# EAGLE design PolarTableMegaShield (EAGLE 9.2.2)
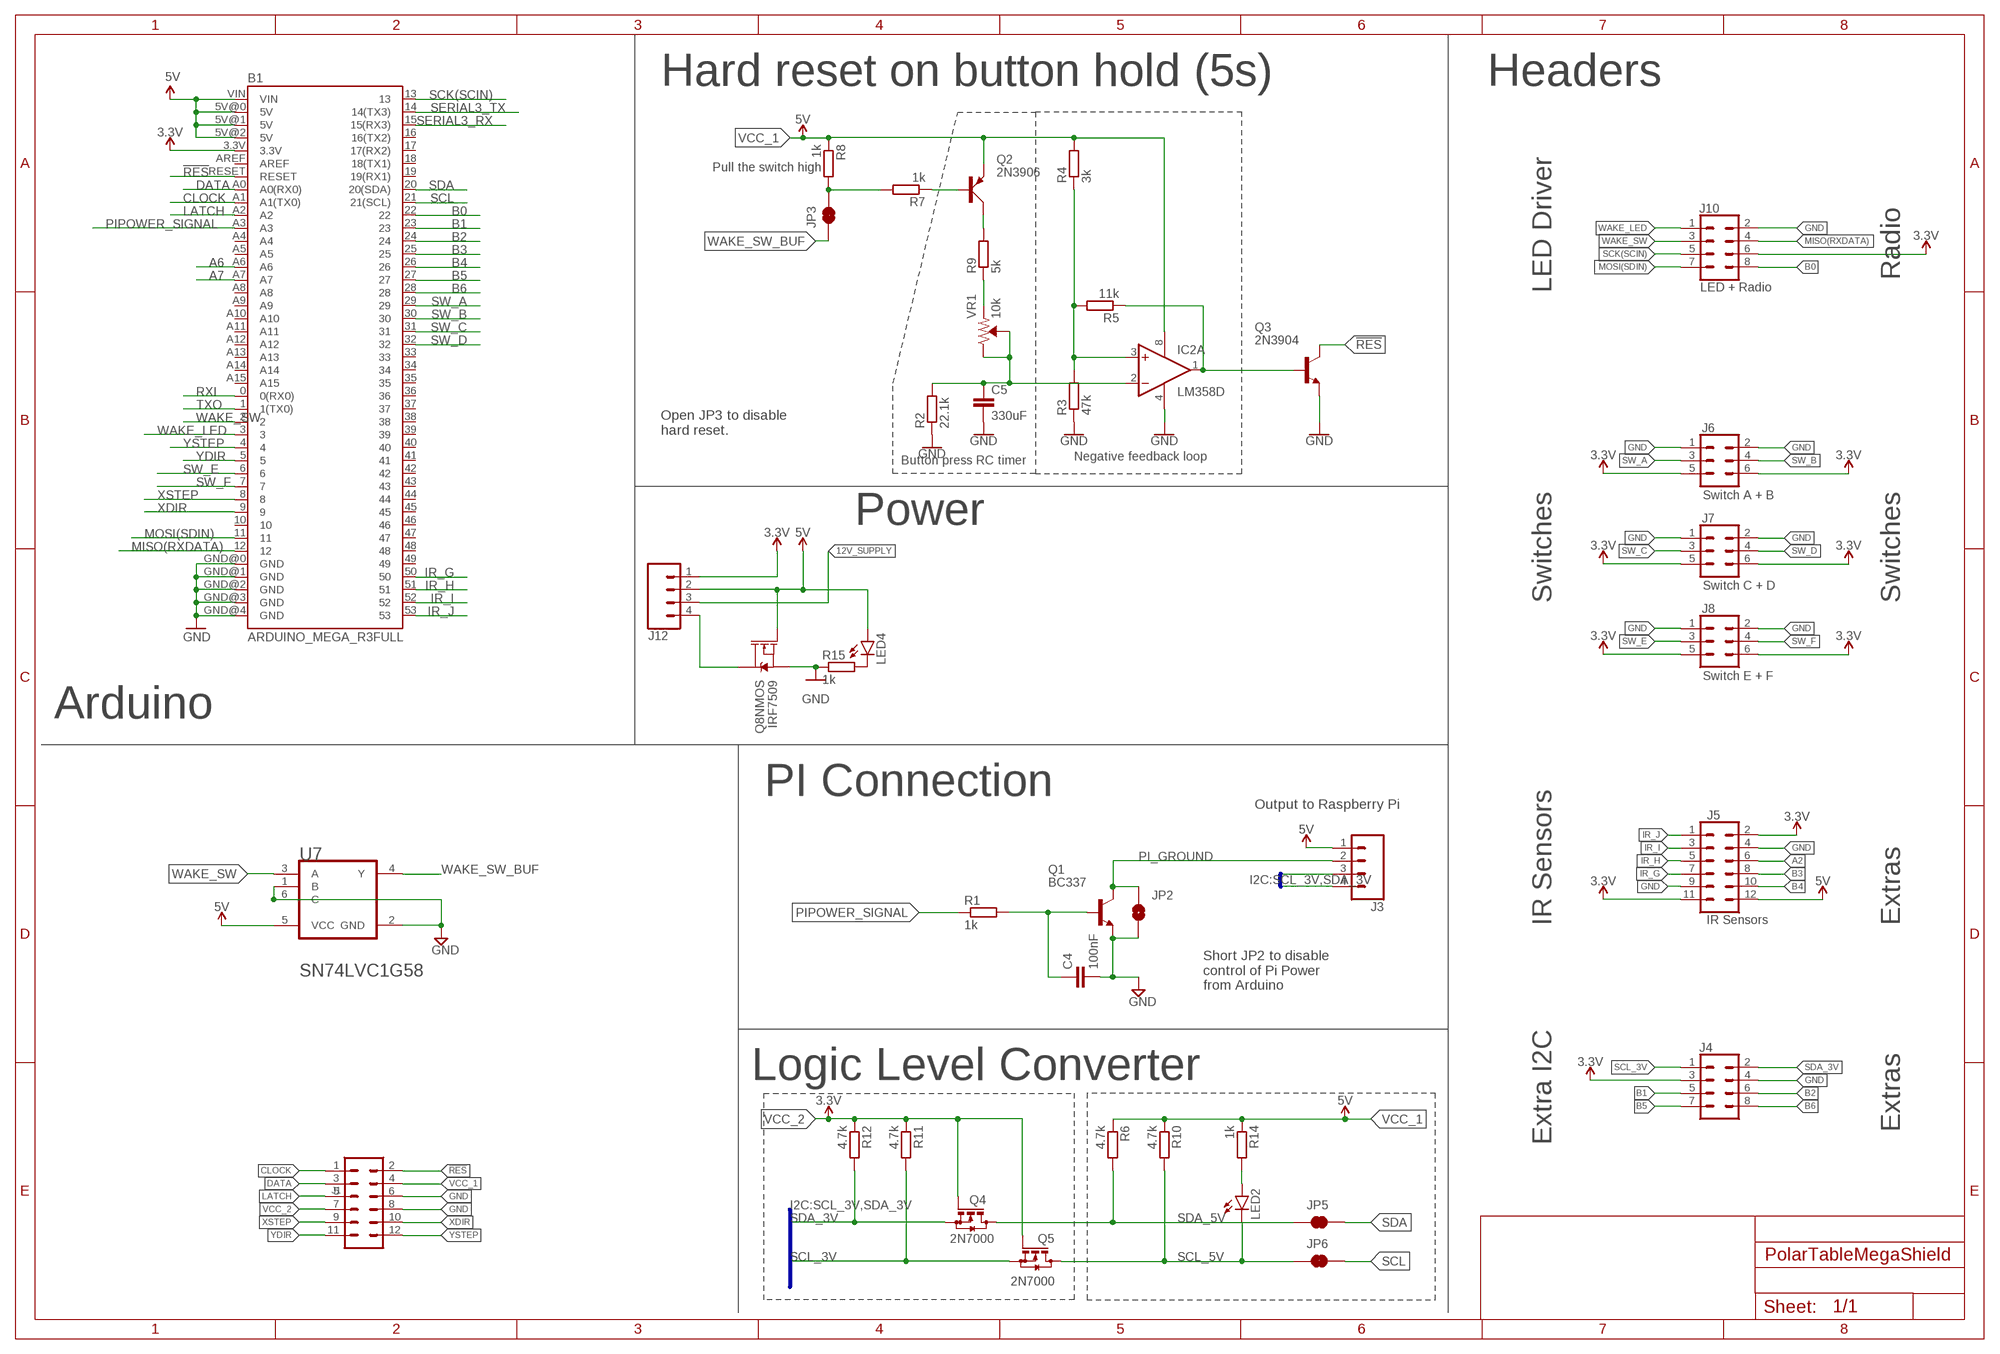
[diagram p0: schematic, sheet 1]

## Parts
B1  ARDUINO_MEGA_R3FULL  [ARDUINO_MEGA]
C4  100nF  C-EUC0805  [C0805]
C5  330uF  C-EUC0805  [C0805]
IC2  LM358D  [SO08]
J1  CONN_06X21.24MM_RA_MALE  [2X6]
J3  Pi Connection  CONN_041X04_1.24MM_RA_MALE  [1X04_1.24MM_RA_MALE]
J4  CONN_04X22X4_1.24MM_RA_MALE  [2X4]
J5  IR Sensors  CONN_06X21.24MM_RA_MALE  [2X6]
J6  Switch A + B  CONN_03X22X03_2.54MM_RA_MALE  [2X3]
J7  Switch C + D  CONN_03X22X03_2.54MM_RA_MALE  [2X3]
J8  Switch E + F  CONN_03X22X03_2.54MM_RA_MALE  [2X3]
J10  LED + Radio  CONN_04X22X4_1.24MM_RA_MALE  [2X4]
J12  CONN_04JST-PTH  [JST-4-PTH]
JP2  JUMPER-SMT_2_NO_SILK  [SMT-JUMPER_2_NO_SILK]
JP3  Enable Hold to Reset  JUMPER-SMT_2_NC_TRACE_SILK  [SMT-JUMPER_2_NC_TRACE_SILK]
JP5  JUMPER-SMT_2_NC_TRACE_NO-SILK  [SMT-JUMPER_2_NC_TRACE_NO-SILK]
JP6  JUMPER-SMT_2_NC_TRACE_NO-SILK  [SMT-JUMPER_2_NC_TRACE_NO-SILK]
LED2  LEDCHIP-LED0805  [CHIP-LED0805]
LED4  LEDCHIP-LED0805  [CHIP-LED0805]
Q1  BC337  [TO92]
Q2  2N3906  [TO92D]
Q3  2N3904  [TO92]
Q4  2N7000  [TO92-]
Q5  2N7000  [TO92-]
Q8  IRF7509  [MSOP8]
R1  1k  R-EU_M0805  [M0805]
R2  22.1k  R-EU_M0805  [M0805]
R3  47k  R-EU_M0805  [M0805]
R4  3k  R-EU_M0805  [M0805]
R5  11k  R-EU_M0805  [M0805]
R6  4.7k  R-EU_M0805  [M0805]
R7  1k  R-EU_M0805  [M0805]
R8  1k  R-EU_M0805  [M0805]
R9  5k  R-EU_M0805  [M0805]
R10  4.7k  R-EU_M0805  [M0805]
R11  4.7k  R-EU_M0805  [M0805]
R12  4.7k  R-EU_M0805  [M0805]
R14  1k  R-EU_M0805  [M0805]
R15  1k  R-EU_M0805  [M0805]
U7  Buffer  TEXAS_INSTRUMENTS_SN74LVC1G58SOT363  [SOT363_PHILIPS]
VR1  10k  TRIMPOT-PTH-10MM-KNOB-1/2W-10%  [TRIMPOT-PTH-3386U]

## Nets
12V_SUPPLY [12v_Supply]: J12.3
!RES [5v]: B1.RESET J1.2 Q3.1(C)
$N99 [5v]: JP3.2 R7.2 R8.2
A2 [5v]: J5.6
A6 [5v]: B1.A6
A7 [5v]: B1.A7
B0 [3v]: B1.22 J10.8
B1 [3v]: B1.23 J4.5
B2 [3v]: B1.24 J4.6
B3 [5v]: B1.25 J5.8
B4 [5v]: B1.26 J5.10
B5 [3v]: B1.27 J4.7
B6 [3v]: B1.28 J4.8
CLOCK [5v]: B1.A1(A1(TX0)) J1.1
COMP_OUT [5v]: IC2.1(A:OUT) Q3.2(B) R5.1
DATA [5v]: B1.A0(A0(RX0)) J1.3
GND [5v]: B1.GND@0(GND) B1.GND@1(GND) B1.GND@2(GND) B1.GND@3(GND) B1.GND@4(GND) C4.2 C5.2 IC2.4(P:V-) J1.6 J1.8 J4.4 J5.4 J5.9 J6.1 J6.2 J7.1 J7.2 J8.1 J8.2 J10.2 JP2.2 Q1.1(E) Q3.3(E) Q8.1(NMOS:S) R2.1 R3.1 R15.1 U7.1(B) U7.2(GND) U7.6(C)
IR_G [3v]: B1.50 J5.7
IR_H [3v]: B1.51 J5.5
IR_I [3v]: B1.52 J5.3
IR_J [3v]: B1.53 J5.1
LATCH [5v]: B1.A2 J1.5
MISO(RXDATA) [5v]: B1.12 J10.4
MOSI(SDIN) [5v]: B1.11 J10.7
N$1 [5v]: Q2.B R7.1
N$2 [5v]: C4.1 Q1.2(B) R1.2
N$3 [5v]: Q2.C R9.2
N$4: J12.4 Q8.7(NMOS:D) Q8.8(NMOS:D)
N$5 [5v]: IC2.3(A:+IN) R3.2 R4.1 R5.2
N$6 [5v]: R9.1 VR1.1(CCW)
N$8 [5v]: C5.1 IC2.2(A:-IN) R2.2 VR1.2(WIPER) VR1.3(CW)
N$9: LED4.C R15.2
N$10 [5v]: LED2.A R14.2
PI_GROUND [5v]: J3.2 JP2.1 Q1.3(C)
PIPOWER_SIGNAL [5v]: B1.A3 R1.1
RXI [5v]: B1.0(0(RX0))
SCK(SCIN) [5v]: B1.13 J10.5
SCL [5v]: B1.21(21(SCL)) JP6.2
SCL_3V [3v]: J3.3 J4.1 Q5.1(S) R11.2
SCL_5V [5v]: JP6.1 LED2.C Q5.3(D) R10.2
SDA [5v]: B1.20(20(SDA)) JP5.2
SDA_3V [3v]: J3.4 J4.2 Q4.1(S) R12.2
SDA_5V [5v]: JP5.1 Q4.3(D) R6.2
SERIAL3_RX: B1.15(15(RX3))
SERIAL3_TX: B1.14(14(TX3))
SW_A [3v]: B1.29 J6.3
SW_B [3v]: B1.30 J6.4
SW_C [3v]: B1.31 J7.3
SW_D [3v]: B1.32 J7.4
SW_E [5v]: B1.6 J8.3
SW_F [5v]: B1.7 J8.4
TXO [5v]: B1.1(1(TX0))
VCC_1 [5v]: B1.5V@0(5V) B1.5V@1(5V) B1.5V@2(5V) B1.VIN IC2.8(P:V+) J1.4 J3.1 J5.12 J12.2 LED4.A Q2.E Q8.2(NMOS:G) R4.2 R6.1 R8.1 R10.1 R14.1 U7.5(VCC) ; supply symbol labelled 5V
VCC_2 [3v]: B1.3.3V J1.7 J4.3 J5.2 J5.11 J6.5 J6.6 J7.5 J7.6 J8.5 J8.6 J10.6 J12.1 Q4.2(G) Q5.2(G) R11.1 R12.1 ; supply symbol labelled 3.3V
WAKE_LED [3v]: B1.3 J10.1
WAKE_SW [5v]: B1.2 J10.3 U7.3(A)
WAKE_SW_BUF [5v]: JP3.1 U7.4(Y)
XDIR [5v]: B1.9 J1.10
XSTEP [5v]: B1.8 J1.9
YDIR [5v]: B1.5 J1.11
YSTEP [5v]: B1.4 J1.12
Unconnected: B1.10 B1.16(16(TX2)) B1.17(17(RX2)) B1.18(18(TX1)) B1.19(19(RX1)) B1.33 B1.34 B1.35 B1.36 B1.37 B1.38 B1.39 B1.40 B1.41 B1.42 B1.43 B1.44 B1.45 B1.46 B1.47 B1.48 B1.49 B1.A4 B1.A5 B1.A8 B1.A9 B1.A10 B1.A11 B1.A12 B1.A13 B1.A14 B1.A15 B1.AREF IC2.5(B:+IN) IC2.6(B:-IN) IC2.7(B:OUT) Q8.3(PMOS:S) Q8.4(PMOS:G) Q8.5(PMOS:D) Q8.6(PMOS:D)

## Buses
I2C:SCL_3V,SDA_3V

## Notes on the sheet
- Hard reset on button hold (5s) | Headers
- Radio
- LED Driver
- Open JP3 to disable
  hard reset.
- Negative feedback loop
- Button press RC timer
- Power
- Switches | Switches
- Arduino
- PI Connection
- Output to Raspberry Pi
- IR Sensors | Extras
- Short JP2 to disable
  control of Pi Power
  from Arduino
- Logic Level Converter
- Extras
- Extra I2C

## Library data of the parts
B1 = SparkFun-Boards:ARDUINO_MEGA_R3: Arduino Mega R3 ATmega2560 R3 compatible footprint. SparkFun Products: Arduino Mega 2560 R3 <https://www.sparkfun.com/products/11061>
C4 C5 = resistor:C-EU: CAPACITOR, European symbol
IC2 = keir_library:LM358: OP AMP also LM158; LM258; LM2904 Source: http://cache.national.com/ds/LM/LM158.pdf
J1 J5 = keir_library:CONN_06X2: Multi connection point. Often used as Generic Header-pin footprint for 0.1 inch spaced/style header connections On any of the 0.1 inch spaced packages, you can populate with these: Break Away Headers - Straight <https://www.sparkfun.com/products/116> (PRT-00116) Break Away Male Headers - Right Angle <https://www.sparkfun.com/products/553> (PRT-00553) Female Headers <https://www.sparkfun.com/products/115> (PRT-00115) Break Away Headers - Machine Pin <https://www.sparkfun.com/products/117> (PRT-00117) Break Away Female Headers - Swiss Machine Pin <https://www.sparkfun.com/products/743> (PRT-00743)
J3 = keir_library:CONN_04: Multi connection point. Often used as Generic Header-pin footprint for 0.1 inch spaced/style header connections On any of the 0.1 inch spaced packages, you can populate with these: Break Away Headers - Straight <https://www.sparkfun.com/products/116> (PRT-00116) Break Away Male Headers - Right Angle <https://www.sparkfun.com/products/553> (PRT-00553) Female Headers <https://www.sparkfun.com/products/115> (PRT-00115) Break Away Headers - Machine Pin <https://www.sparkfun.com/products/117> (PRT-00117) Break Away Female Headers - Swiss Machine Pin <https://www.sparkfun.com/products/743> (PRT-00743) For SCREWTERMINALS and SPRING TERMINALS visit here: Screw Terimnals on SparkFun.com <https://www.sparkfun.com/search/results?term=Screw+Terminals> (5mm/3.5mm/2.54mm spacing) This device is also useful as a general connection point to wire up your design to another part of your project. Our various solder wires solder well into these plated through hole pads. Hook-Up Wire - Assortment (Stranded, 22 AWG) <https://www.sparkfun.com/products/11375> (PRT-11375) Hook-Up Wire - Assortment (Solid Core, 22 AWG) <https://www.sparkfun.com/products/11367> (PRT-11367) View the entire wire category on our website here <https://www.sparkfun.com/categories/141> Special notes: Molex polarized connector foot print use with SKU : PRT-08231 with associated crimp pins and housings. 1MM SMD Version SKU: PRT-10208
J4 J10 = keir_library:CONN_04X2: Multi connection point. Often used as Generic Header-pin footprint for 0.1 inch spaced/style header connections On any of the 0.1 inch spaced packages, you can populate with these: Break Away Headers - Straight <https://www.sparkfun.com/products/116> (PRT-00116) Break Away Male Headers - Right Angle <https://www.sparkfun.com/products/553> (PRT-00553) Female Headers <https://www.sparkfun.com/products/115> (PRT-00115) Break Away Headers - Machine Pin <https://www.sparkfun.com/products/117> (PRT-00117) Break Away Female Headers - Swiss Machine Pin <https://www.sparkfun.com/products/743> (PRT-00743)
J6-J8 = keir_library:CONN_03X2: Multi connection point. Often used as Generic Header-pin footprint for 0.1 inch spaced/style header connections You can populate with any combo of single row headers, but if you'd like an exact match, check these: Header - 2x3 (Male, 0.1") <https://www.sparkfun.com/products/12807> (PRT-12807) Header - 2x3 (Female, 0.1") <https://www.sparkfun.com/products/13010> (PRT-13010) 2x3 Pin Shrouded Header <https://www.sparkfun.com/products/10877> (PRT-10877) On any of the 0.1 inch spaced packages, you can populate with these: Break Away Headers - Straight <https://www.sparkfun.com/products/116> (PRT-00116) Break Away Male Headers - Right Angle <https://www.sparkfun.com/products/553> (PRT-00553) Female Headers <https://www.sparkfun.com/products/115> (PRT-00115) Break Away Headers - Machine Pin <https://www.sparkfun.com/products/117> (PRT-00117) Break Away Female Headers - Swiss Machine Pin <https://www.sparkfun.com/products/743> (PRT-00743) Special note: the shrouded connector mates well with our 3x2 ribbon cables: Ribbon Crimp Connector - 6-pin (2x3, Female) <https://www.sparkfun.com/products/10651> (PRT-10651) Ribbon Cable - 6 wire (15ft) <https://www.sparkfun.com/products/10646> (PRT-10646)
J12 = SparkFun-Connectors:CONN_04: Multi connection point. Often used as Generic Header-pin footprint for 0.1 inch spaced/style header connections On any of the 0.1 inch spaced packages, you can populate with these: Break Away Headers - Straight <https://www.sparkfun.com/products/116> (PRT-00116) Break Away Male Headers - Right Angle <https://www.sparkfun.com/products/553> (PRT-00553) Female Headers <https://www.sparkfun.com/products/115> (PRT-00115) Break Away Headers - Machine Pin <https://www.sparkfun.com/products/117> (PRT-00117) Break Away Female Headers - Swiss Machine Pin <https://www.sparkfun.com/products/743> (PRT-00743) For SCREWTERMINALS and SPRING TERMINALS visit here: Screw Terimnals on SparkFun.com <https://www.sparkfun.com/search/results?term=Screw+Terminals> (5mm/3.5mm/2.54mm spacing) This device is also useful as a general connection point to wire up your design to another part of your project. Our various solder wires solder well into these plated through hole pads. Hook-Up Wire - Assortment (Stranded, 22 AWG) <https://www.sparkfun.com/products/11375> (PRT-11375) Hook-Up Wire - Assortment (Solid Core, 22 AWG) <https://www.sparkfun.com/products/11367> (PRT-11367) View the entire wire category on our website here <https://www.sparkfun.com/categories/141> Special notes: Molex polarized connector foot print use with SKU : PRT-08231 with associated crimp pins and housings. 1MM SMD Version SKU: PRT-10208; PROD_ID: WIRE-13531; SF_ID: PRT-09916
JP2 = SparkFun-Jumpers:JUMPER-SMT_2_NO: Normally open jumper This jumper has two pads in close proximity to each other. Apply solder to close the connection. Round pads are easier to solder for beginners, but are a lot larger. SparkFun Product that uses the round pads: SparkFun EL Sequencer <https://www.sparkfun.com/products/12781>
JP3 JP5 JP6 = SparkFun-Jumpers:JUMPER-SMT_2_NC_TRACE: Normally closed trace jumper This jumper has a trace between two pads so it's normally closed (NC). Use a razor knife to open the connection. For best results follow the IPC guidelines for cutting traces: Cutout at least 0.063 mm (0.005 in). Remove all loose material to clean up the cut area. Seal the cut with an approved epoxy. Reapply solder to reclose the connection.
LED2 LED4 = led:LED: LED OSRAM: - CHIPLED LG R971, LG N971, LY N971, LG Q971, LY Q971, LO R971, LY R971 LH N974, LH R974 LS Q976, LO Q976, LY Q976 LO Q996 - Hyper CHIPLED LW Q18S LB Q993, LB Q99A, LB R99A - SideLED LS A670, LO A670, LY A670, LG A670, LP A670 LB A673, LV A673, LT A673, LW A673 LH A674 LY A675 LS A676, LA A676, LO A676, LY A676, LW A676 LS A679, LY A679, LG A679 - Hyper Micro SIDELED® LS Y876, LA Y876, LO Y876, LY Y876 LT Y87S - SmartLED LW L88C, LW L88S LB L89C, LB L89S, LG L890 LS L89K, LO L89K, LY L89K LS L896, LA L896, LO L896, LY L896 - TOPLED LS T670, LO T670, LY T670, LG T670, LP T670 LSG T670, LSP T670, LSY T670, LOP T670, LYG T670 LG T671, LOG T671, LSG T671 LB T673, LV T673, LT T673, LW T673 LH T674 LS T676, LA T676, LO T676, LY T676, LB T676, LH T676, LSB T676, LW T676 LB T67C, LV T67C, LT T67C, LS T67K, LO T67K, LY T67K, LW E67C LS E67B, LA E67B, LO E67B, LY E67B, LB E67C, LV E67C, LT E67C LW T67C LS T679, LY T679, LG T679 LS T770, LO T770, LY T770, LG T770, LP T770 LB T773, LV T773, LT T773, LW T773 LH T774 LS E675, LA E675, LY E675, LS T675 LS T776, LA T776, LO T776, LY T776, LB T776 LHGB T686 LT T68C, LB T68C - Hyper Mini TOPLED® LB M676 - Mini TOPLED Santana® LG M470 LS M47K, LO M47K, LY M47K Source: http://www.osram.convergy.de LUXEON: - LUMILED® LXK2-PW12-R00, LXK2-PW12-S00, LXK2-PW14-U00, LXK2-PW14-V00 LXK2-PM12-R00, LXK2-PM12-S00, LXK2-PM14-U00 LXK2-PE12-Q00, LXK2-PE12-R00, LXK2-PE12-S00, LXK2-PE14-T00, LXK2-PE14-U00 LXK2-PB12-K00, LXK2-PB12-L00, LXK2-PB12-M00, LXK2-PB14-N00, LXK2-PB14-P00, LXK2-PB14-Q00 LXK2-PR12-L00, LXK2-PR12-M00, LXK2-PR14-Q00, LXK2-PR14-R00 LXK2-PD12-Q00, LXK2-PD12-R00, LXK2-PD12-S00 LXK2-PH12-R00, LXK2-PH12-S00 LXK2-PL12-P00, LXK2-PL12-Q00, LXK2-PL12-R00 Source: www.luxeon.com KINGBRIGHT: KA-3528ASYC Source: www.kingbright.com
Q1 = transistor-npn:BC337*: NPN Transistor
Q2 = transistor-small-signal:2N3906: PNP TRANSISTOR
Q3 = transistor-npn:2N3904: NPN Transistor; NOTE: Pull high until we get comparitor high output
Q4 Q5 = keir_library:2N7000: N-CHANNEL MOS FET
Q8 = SparkFun-DiscreteSemi:IRF7509: Dual N and P Channel MOSFET Dual N/P-Channel 30V 1.25 W 7.8/7.5 nC Hexfet Power Mosfet Surface Mount-MICRO-8. NMOS RDS(ON) 0.11Ω. PMOS RDS(ON) 0.20Ω. Link to datasheet <http://www.irf.com/product-info/datasheets/data/irf7509pbf.pdf> SparkFun Products: SparkFun RedBot Mainboard <https://www.sparkfun.com/products/12097> SparkFun Wake on Shake <https://www.sparkfun.com/products/11447>; PROD_ID: TRANS-07913
R1-R7 R9-R12 R14 R15 = rcl:R-EU_: RESISTOR, European symbol; SPICEPREFIX: R
R8 = rcl:R-EU_: RESISTOR, European symbol; NOTE: Pull the switch high; SPICEPREFIX: R
U7 = Texas Instruments - SN74LVC1G58:TEXAS_INSTRUMENTS_SN74LVC1G58: 74LVC1G58 Low-power configurable multiple function gate Data sheet <https://assets.nexperia.com/documents/data-sheet/74LVC1G58.pdf>
VR1 = SparkFun-Resistors:TRIMPOT: Trimming Potentiometer (Trimpot) Three-terminal potentiometers, with an adjustable wiper and two adjustable resistors. A pot can be used to create a configurable voltage divider, or as a variable resistor. "Trimpots" are a subset of potentiometers, usually intended for "set-and-forget" applications. They're often more delicate than standard potentiometers - rated for fewer turns. Variants PTH-KNOB - PTH Trimpot w/ finger-adjustable knob Trimpot 10K with Knob <https://www.sparkfun.com/products/9806> (COM-09806) Datasheet <http://www.sparkfun.com/datasheets/Components/General/TSR-3386.pdf> SMD-3MM-CLOSED-FRAME - SMD 3mm Square Closed-Frame Trimpot Used on e.g. EasyDriver - Stepper Motor Driver <https://www.sparkfun.com/products/12779> Datasheet <http://www.bitechnologies.com/pdfs/22.pdf> (22AR10KTR) SMD-5MM - SMD 5mm Square Closed-Frame Trimpot Used on e.g. IOIO-OTG - V2.2 <https://www.sparkfun.com/products/13613> Datasheet <http://www.vishay.com/docs/51008/ts53.pdf> (TS53YL502MR10) SMD-3MM-1/10W-25% - 3mm Square Open-Frame Trimpot Used on e.g. SparkFun Shapeoko <https://www.sparkfun.com/products/13899> Datasheet <http://www.bourns.com/docs/Product-Datasheets/TC33.pdf> (TC33X-2-103E); PROD_ID: RES-09730; SF_SKU: COM-09806

## Net classes
1 12v_Supply: width 1.2 mm, clearance 0.31 mm
2 5v_Supply: width 1 mm

## Board
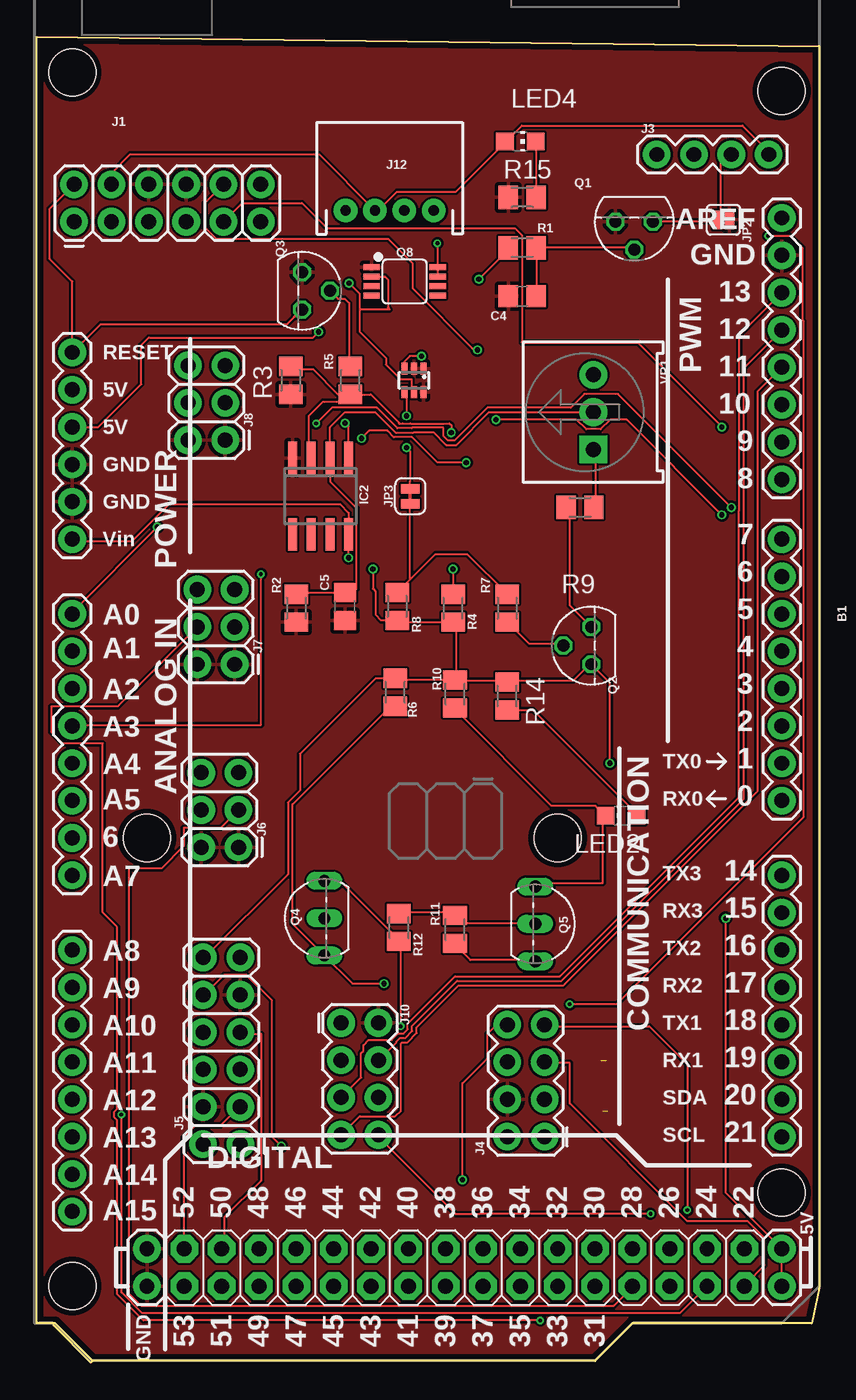
[diagram p1: board, top side]
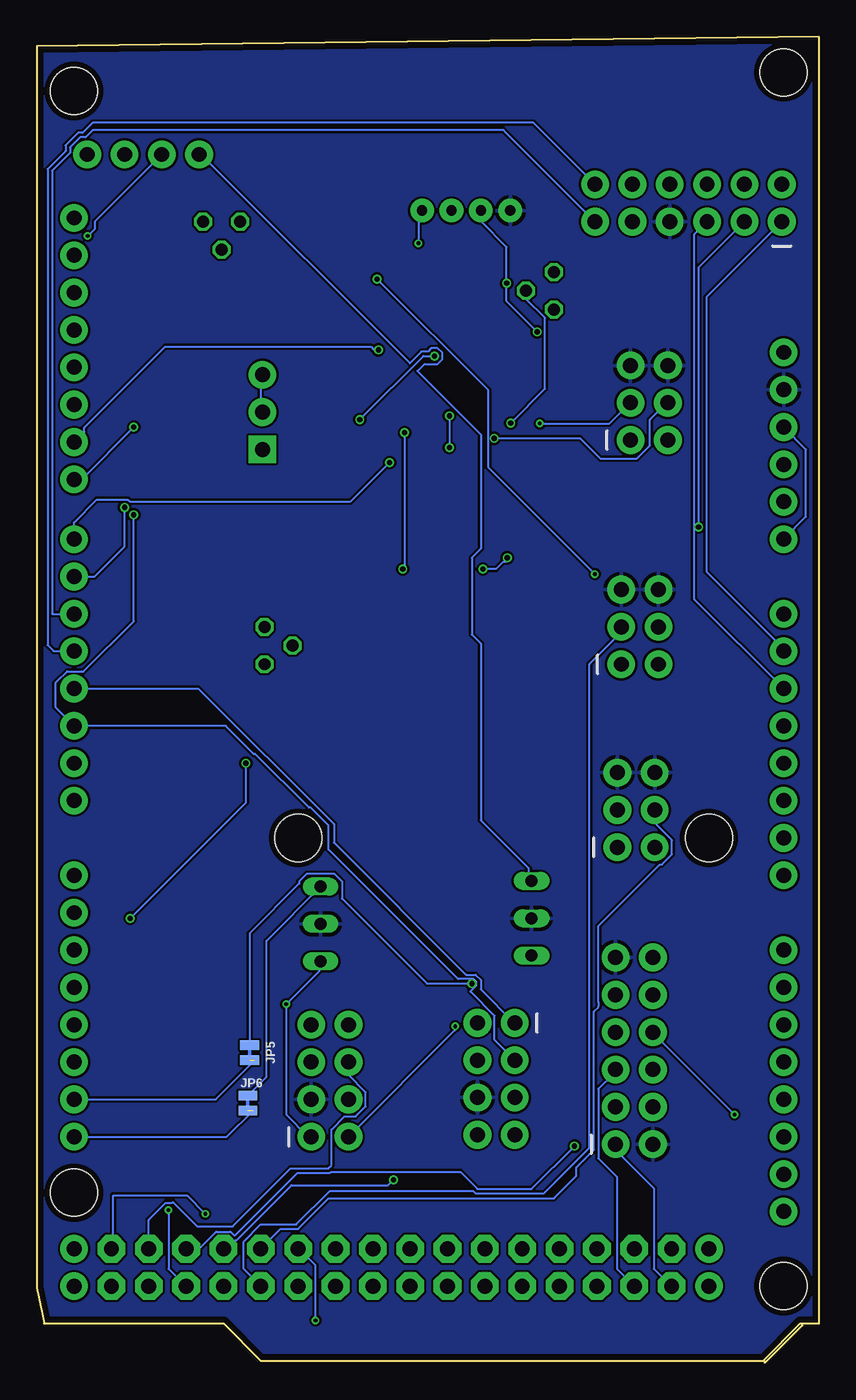
[diagram p2: board, bottom side, seen from below]

Size 53.21 x 90.17 mm. Coordinates in mm from the lower left corner, seen from the top.
Outline: 3.81,0.13 1.27,2.67 1.14,2.67
Outline: 1.14,2.67 0,2.67 0,90.17 53.21,89.53 53.21,5.08 52.7,2.67 40.51,2.67 37.97,0.13 3.81,0.13
Outline: 3.81,0.13 3.68,0 1.14,2.54 1.14,2.67
Copper layers (1*16): Top 0.035559375mm / dielectric 1.6mm / Bottom 0.035559375mm
Design rules "oshpark-2layer": minimum track width 6mil, minimum drill 10mil, track to track 6mil, track to pad 6mil, pad to pad 6mil, via to via 6mil, smd to smd 6mil, copper to edge 15mil, drill to drill 6mil, minimum pad ring 5mil, minimum via ring 5mil, stop-mask expansion 2.5mil, vias tented up to drill 0mil, thermal gap 10mil

### Footprints (pad centres in the part's own frame; a part is rotated, then mirrored left to right if it is on the bottom)
ARDUINO_MEGA = drill 1.016 pad 1.88: 0 13.97,24.13; 1 11.43,24.13; 2 8.89,24.13; 3 6.35,24.13; 3.3V -13.97,-24.13; 4 3.81,24.13; 5 1.27,24.13; 5V@0 -11.43,-24.13; 5V@1 44.45,24.13; 5V@2 46.99,24.13; 6 -1.27,24.13; 7 -3.81,24.13; 8 -7.874,24.13; 9 -10.414,24.13; 10 -12.954,24.13; 11 -15.494,24.13; 12 -18.034,24.13; 13 -20.574,24.13; 14 19.05,24.13; 15 21.59,24.13; 16 24.13,24.13; 17 26.67,24.13; 18 29.21,24.13; 19 31.75,24.13; 20 34.29,24.13; 21 36.83,24.13; A0 1.27,-24.13; A1 3.81,-24.13; A2 6.35,-24.13; A3 8.89,-24.13; A4 11.43,-24.13; A5 13.97,-24.13; A6 16.51,-24.13; A7 19.05,-24.13; A8 24.13,-24.13; A9 26.67,-24.13; A10 29.21,-24.13; A11 31.75,-24.13; A12 34.29,-24.13; A13 36.83,-24.13; A14 39.37,-24.13; A15 41.91,-24.13; AREF -25.654,24.13; GND@0 -8.89,-24.13; GND@1 -6.35,-24.13; GND@2 44.45,-19.05; GND@3 46.99,-19.05; GND@4 -23.114,24.13; RESET -16.51,-24.13; VIN -3.81,-24.13 | drill 1.016 pad 1.88 octagon: 22 44.45,21.59; 23 46.99,21.59; 24 44.45,19.05; 25 46.99,19.05; 26 44.45,16.51; 27 46.99,16.51; 28 44.45,13.97; 29 46.99,13.97; 30 44.45,11.43; 31 46.99,11.43; 32 44.45,8.89; 33 46.99,8.89; 34 44.45,6.35; 35 46.99,6.35; 36 44.45,3.81; 37 46.99,3.81; 38 44.45,1.27; 39 46.99,1.27; 40 44.45,-1.27; 41 46.99,-1.27; 42 44.45,-3.81; 43 46.99,-3.81; 44 44.45,-6.35; 45 46.99,-6.35; 46 44.45,-8.89; 47 46.99,-8.89; 48 44.45,-11.43; 49 46.99,-11.43; 50 44.45,-13.97; 51 46.99,-13.97; 52 44.45,-16.51; 53 46.99,-16.51 | hole 3.2: -34.29,24.13; -35.56,-24.13; 16.51,8.89; 16.51,-19.05; 40.64,24.13; 46.99,-24.13
C0805 = smd 1.3 x 1.5: 1 -0.95,0; 2 0.95,0
SO08 = smd 0.6 x 2.2: 1 -1.905,-2.6; 2 -0.635,-2.6; 3 0.635,-2.6; 4 1.905,-2.6; 5 1.905,2.6; 6 0.635,2.6; 7 -0.635,2.6; 8 -1.905,2.6
2X6 = drill 1.016 pad 1.88: 1 0,0; 2 0,2.54; 3 2.54,0; 4 2.54,2.54; 5 5.08,0; 6 5.08,2.54; 7 7.62,0; 8 7.62,2.54; 9 10.16,0; 10 10.16,2.54; 11 12.7,0; 12 12.7,2.54
1X04_1.24MM_RA_MALE = drill 1.016 pad 1.88: 1 0,0; 2 2.54,0; 3 5.08,0; 4 7.62,0
2X4 = drill 1.016 pad 1.88: 1 -3.81,-1.27; 2 -3.81,1.27; 3 -1.27,-1.27; 4 -1.27,1.27; 5 1.27,-1.27; 6 1.27,1.27; 7 3.81,-1.27; 8 3.81,1.27
2X3 = drill 1.016 pad 1.88: 1 0,0; 2 0,2.54; 3 2.54,0; 4 2.54,2.54; 5 5.08,0; 6 5.08,2.54
JST-4-PTH = drill 0.7 pad 1.6: 1 -3,0; 2 -1,0; 3 1,0; 4 3,0
SMT-JUMPER_2_NO_SILK = smd 0.635 x 1.27: 1 -0.406,0; 2 0.406,0
SMT-JUMPER_2_NC_TRACE_SILK = smd 0.635 x 1.27: 1 -0.508,0; 2 0.508,0
SMT-JUMPER_2_NC_TRACE_NO-SILK = smd 0.635 x 1.27: 1 -0.508,0; 2 0.508,0
CHIP-LED0805 = smd 1.2 x 1.2: A 0,-1.05; C 0,1.05
TO92 = drill 0.813 octagon: 1 1.27,0; 2 0,1.905; 3 -1.27,0
TO92D = drill 0.813 octagon: B 0,1.905; C 1.27,0; E -1.27,0
TO92- = drill 0.813 long: 1 2.54,0; 2 0,0; 3 -2.54,0
MSOP8 = smd 0.4 x 1.1: 1 -0.975,-2.25; 2 -0.325,-2.25; 3 0.325,-2.25; 4 0.975,-2.25; 5 0.975,2.25; 6 0.325,2.25; 7 -0.325,2.25; 8 -0.975,2.25
M0805 = smd 1.3 x 1.6: 1 -0.95,0; 2 0.95,0
SOT363_PHILIPS = smd 0.4 x 0.8: 1 -0.65,-0.8; 2 0,-0.8; 3 0.65,-0.8; 4 0.65,0.8; 5 0,0.8; 6 -0.65,0.8
TRIMPOT-PTH-3386U = drill 1.016 pad 1.88 square: 1 -2.54,-0.015 | drill 1.016 pad 1.88: 2 0,-0.015; 3 2.54,-0.015

### Placement (x,y rotation side)
B1  26.54,52.2 270 top
C4  33.02,72.52 180 top
C5  20.95,51.44 270 top
IC2  19.3,58.93 180 top
J1  2.54,77.6 0 top
J3  49.78,82.17 180 top
J4  33.27,19.18 90 top
J5  13.84,14.86 90 top
J6  13.72,35.05 90 top
J7  13.46,47.5 90 top
J8  12.83,62.74 90 top
J10  21.97,19.3 270 top
J12  24,78.36 0 top
JP2  46.71,77.72 0 top
JP3  25.4,58.93 270 top
JP5  38.73,21.08 270 bottom
JP6  38.86,17.65 270 bottom
LED2  39.75,37.21 90 top
LED4  32.89,83.06 270 top
Q1  40.64,77.6 180 top
Q2  37.72,48.77 90 top
Q3  18.03,72.9 270 top
Q4  19.56,30.23 90 top
Q5  33.91,29.84 270 top
Q8  25.02,73.53 270 top
R1  33.02,75.82 0 top
R2  17.65,51.31 90 top
R3  17.27,66.8 90 top
R4  28.32,51.31 270 top
R5  21.34,66.8 270 top
R6  24.38,45.59 270 top
R7  32,51.31 90 top
R8  24.51,51.44 90 top
R9  36.96,58.17 180 top
R10  28.45,45.47 270 top
R11  28.45,29.46 270 top
R12  24.64,29.59 270 top
R14  32,45.34 270 top
R15  33.02,79.25 0 top
U7  25.65,66.8 180 top
VR1  37.85,64.64 90 top

### Tracks (layer width: path | path; a pad name or v marks a point on that pad's centre or on a via)
!RES
  Top 0.152: 17.5,71.13 18,71.63 Q3.1 17.03,70.63 4.33,70.63 B1.RESET 2.41,73.53 0.89,75.06 0.89,78.49 J1.2
$N99
  Top 0.152: JP3.2 25.4,53.27 R8.2 27.12,54.99 29.27,54.99 R7.2
B0  (via drill 0.25)
  Top 0.152: J10.8 23.25,15.38 28.52,10.11 30.1,10.11 30.12,10.13 v41.75,10.13
  Bottom 0.152: v41.75,10.13 43,11.38 48,11.38 48,7.88 B1.22
B1
  Top 0.152: B1.23 48.25,5.38 49.5,6.63 49.5,8.49 48.36,9.63 44.25,9.63 36.25,17.63 36.25,20.38 34.75,20.38 J4.5
B2
  Bottom 0.152: B1.24 45.59,9.72 44.45,10.86 44,10.86 43.94,10.92 42.29,9.27 39.88,9.27 35.94,13.21 33.4,13.21 33.17,13.44 33.17,15.85 32.28,16.74 31.52,16.74 30.84,17.42 30.84,18.39 32,19.56 J4.6
B3  (via drill 0.25)
  Top 0.152: B1.25 45.5,5.13 43.75,3.38 7.17,3.38 5.77,4.78 5.77,16.61 5.75,16.63 v5.75,16.88
  Bottom 0.152: v5.75,16.88 11.25,22.38 J5.8
B4  (via drill 0.35)
  Top 0.152: J5.10 11.5,25.13 12.75,26.38 14.25,26.38 15.99,24.63 15.99,15.37 v16.64,14.73
  Bottom 0.152: B1.26 42.16,7.75 41,8.92 40.03,8.92 39.75,8.64 35.48,12.9 33.27,12.9 33.2,12.98 24.41,12.98 23.24,11.81 19.56,11.81 v16.64,14.73
B5  (via drill 0.25)
  Top 0.152: J4.7 34.75,22.88 41.66,22.88 44.25,20.28 v44.25,10.38
  Bottom 0.152: v44.25,10.38 44.25,6.38 43.25,5.38 B1.27
B6  (via drill 0.35)
  Top 0.152: J4.8 32,22.88 31.18,22.88 30.66,22.35 30.66,20.7 28.96,19 v28.96,12.45
  Bottom 0.152: v28.96,12.45 29.34,12.07 35.89,12.07 39.62,8.33 39.93,8.33 B1.28
CLOCK
  Bottom 0.152: B1.A1 2.41,48.54 7.67,53.8 7.67,72.47 J1.1
COMP_OUT  (via drill 0.35)
  Top 0.152: R5.1 21.25,67.88 21.25,72.06 20.95,72.36 20.48,72.36 Q3.2 | IC2.1 21.21,63.67 v20.98,63.9
  Bottom 0.152: Q3.2 20,72.88 20,72.41 18.65,71.05 18.65,66.23 v20.98,63.9
DATA  (via drill 0.35)
  Top 0.152: v8.2,56.83 2.5,51.13 B1.A0
  Bottom 0.152: J1.3 8.2,74.48 v8.2,56.83
GND
  pour Top: 3.68,0.13 1.27,2.54 1.27,2.67 1.14,2.79 -0.13,2.79 -0.13,101.6 55.77,101.6 55.77,5.1 53.34,2.67 40.64,2.67 40.51,2.79 40.51,2.67 37.97,0.13
IR_G
  Top 0.152: B1.50 12.75,7.88 12.75,9.88 15.25,12.38 15.25,22.38 14,22.38 J5.7
IR_H
  Bottom 0.152: B1.51 12.75,5.38 13.75,6.38 13.75,12.63 15.01,13.89 15.01,18.62 14,19.63 14,19.88 J5.5
IR_I
  Top 0.152: B1.52 10,7.88 10,15.33 10.79,16.13 12.5,16.13 13.75,17.38 J5.3
IR_J
  Bottom 0.152: B1.53 10.25,5.38 11.25,6.38 11.25,11.88 13.75,14.38 13.75,14.63 J5.1
LATCH
  Bottom 0.152: B1.A2 8.51,51.94 8.51,76.71 J1.5
MISO(RXDATA)
  Top 0.152: J10.4 24.46,21.79 24.46,21.84 24.71,22.09 25.08,22.09 25.54,22.55 25.54,22.92 28.59,25.97 35.7,25.97 48.08,38.35 48.08,67.64 B1.12
MOSI(SDIN)
  Top 0.152: B1.11 49.02,66.04 49.02,38.86 35.81,25.65 28.7,25.65 25.84,22.79 25.84,22.42 25.2,21.79 24.83,21.79 24.77,21.72 24.77,17.14 24.38,16.76 21.97,16.76 J10.7
N$1
  Top 0.152: R7.1 32.25,50.13 33.5,48.88 35.75,48.88 Q2.B
N$2
  Top 0.152: C4.1 34,72.63 34,75.63 R1.2 34,75.88 40.5,75.88 Q1.2
N$3
  Top 0.152: R9.2 36.25,58.13 36.25,51.51 Q2.C
N$4  (via drill 0.25)
  Top 0.152: Q8.7 27.25,73.88 27.25,74.38 Q8.8 27.25,74.63 v27.25,76.13
  Bottom 0.152: v27.25,76.13 27.25,78.13 J12.4
N$5  (via drill 0.35)
  Top 0.152: 21.25,65.88 R5.2 | 28.25,52.38 R4.1 v28.32,53.98 | 18.75,61.38 IC2.3 18.5,61.63 18.5,64.38 19.48,65.36 20.84,65.36 R5.2 | R5.2 22.73,65.85 24.64,63.95 24.64,63.88 24.9,63.88 24.93,63.86 25.37,63.86 25.39,63.88 28.07,63.88 28.19,63.75 v28.19,63.25 | R3.2 17.46,67.56 18.8,67.56 20.51,65.85 R5.2
  Bottom 0.152: v28.19,63.25 28.19,54.1 v28.32,53.98
N$6
  Top 0.152: R9.1 38,58.38 38,61.88 VR1.1
N$8
  Top 0.152: R2.2 17.75,52.38 20.75,52.38 C5.1 21,52.63 21.75,52.63 21.75,58.13 20,59.88 20,61.38 IC2.2 19.94,63.62 20.97,64.64 23.01,64.64 24.41,63.25 25.62,63.25 25.64,63.27 26.99,63.27 27.85,62.41 28.54,62.41 30.77,64.64 VR1.2
  Bottom 0.152: VR1.2 38,64.88 38,67.13 VR1.3
N$9
  Top 0.152: LED4.C 34,82.88 34,79.38 R15.2
N$10
  Top 0.152: LED2.A 40.75,37.38 33.75,44.38 32.25,44.38 R14.2
PI_GROUND
  Top 0.152: Q1.3 42,77.63 46.25,77.63 JP2.1 46.5,77.88 46.5,82.13 47,82.13 J3.2
PIPOWER_SIGNAL  (via drill 0.25, 0.35)
  Top 0.152: v30.07,73.69 32,75.63 R1.1 | v15.25,53.63 15.25,43.38 2.5,43.38 B1.A3
  Bottom 0.152: v15.25,53.63 22.5,60.88 22.5,66.13 v30.07,73.69
SCK(SCIN)
  Top 0.152: 20.75,18.13 J10.5 22.07,19.41 22.07,21.06 22.23,21.21 22.23,21.59 22.58,21.95 24.13,21.95 24.58,22.39 24.95,22.39 25.23,22.68 25.23,23.05 28.46,26.28 35.57,26.28 47.75,38.45 47.75,57.92 47.77,57.95 47.77,69.87 B1.13
SCL  (1 unrouted)
  Bottom 0.152: 38.51,17.14 40.28,15.37 B1.21
SCL_3V  (via drill 0.25)
  Top 0.152: R11.2 28.5,28.38 29.5,27.38 33.75,27.38 Q5.1 | v49.75,76.63 51.25,76.63 52.06,75.81 52.06,70.92 52.15,70.84 52.15,37.08 39.44,24.38 v36.25,24.38
  Bottom 0.152: J4.1 34.75,15.38 36.25,16.88 v36.25,24.38 34,26.63 34,27.13 Q5.1 | v49.75,76.63 49.25,77.13 49.25,77.63 44.75,82.13 J3.3
SCL_5V
  Top 0.152: Q5.3 34,32.63 38.5,32.63 38.5,37.13 LED2.C 38.5,37.38 38,37.88 35,37.88 28.5,44.38 R10.2
  Bottom 0.152: JP6.1 37.59,19.43 37.59,28.7 Q5.3
SDA  (1 unrouted)
  Bottom 0.152: 38.38,20.57 41.05,17.91 B1.20
SDA_3V  (via drill 0.25)
  Top 0.152: Q4.1 19.75,32.63 20.75,32.63 24.5,28.88 R12.2 24.75,28.63 v24.75,22.88
  Bottom 0.152: v24.75,22.88 24.75,22.63 J4.2 | J3.4 42,82.13 27.84,67.97 27.05,68.76 26.61,68.76 26.38,68.99 25.94,68.99 25.63,68.68 25.63,68.24 25.94,67.93 26.83,67.93 27.32,67.44 23,63.13 23,55.37 23.62,54.75 23.62,49.52 23,48.9 23,36.88 19.75,33.63 19.75,32.88 Q4.1
SDA_5V  (via drill 0.35)
  Top 0.152: v23.62,25.78 21.46,25.78 Q4.3 17.4,29.84 17.4,37.97 24.07,44.64 R6.2
  Bottom 0.152: JP5.1 38.73,29.21 35.36,32.59 35.36,32.73 34.87,33.22 32.95,33.22 32.46,32.73 32.46,31.57 26.67,25.78 v23.62,25.78
SW_A
  Top 0.152: B1.29 40.5,5.13 39.25,3.88 7.1,3.88 6.25,4.73 6.25,33.63 8.5,33.63 10,35.13 10,36.38 12.5,36.38 13.5,37.38 J6.3
SW_B
  Bottom 0.152: J6.4 11.18,36.7 10.01,35.54 10.01,34.57 10.69,33.88 10.82,33.88 15.01,29.69 15.01,24.54 14.99,24.51 14.99,24.26 15.02,24.23 15.02,24.18 15.32,23.88 15.32,14.48 16.51,13.29 16.51,12.7 18.03,11.18 33.35,11.18 35.43,9.09 36.63,9.09 B1.30
SW_C
  Bottom 0.152: J7.3 13.5,49.88 13.5,49.63 15.62,47.51 15.62,14.61 18.72,11.51 23.37,11.51 23.55,11.68 33.27,11.68 35.56,9.4 37.97,9.4 39.14,8.23 39.14,6.38 B1.31
SW_D  (via drill 0.25)
  Top 0.152: v34.25,2.88 7.24,2.88 5.46,4.65 5.46,16.48 5.27,16.68 5.27,17.08 5.46,17.27 5.46,29.65 4.5,30.61 4.5,42.13 1.75,42.13 1,42.88 1,44.63 5.5,44.63 10.75,49.88 J7.4
  Bottom 0.152: v34.25,2.88 34.25,6.63 35.25,7.63 B1.32
SW_E  (via drill 0.25, 0.35)
  Top 0.152: v19,63.88 20.07,64.95 23.14,64.95 24.53,63.55 25.49,63.55 25.52,63.58 27.66,63.58 27.66,63.03 27.97,62.72 28.41,62.72 30.65,64.95 36.32,64.95 37.25,65.88 39.53,65.88 v47.24,58.17
  Bottom 0.152: v19,63.88 14.25,63.88 13,65.13 J8.3 | B1.6 49.28,53.47 47.24,55.5 v47.24,58.17
SW_F  (via drill 0.35)
  Top 0.152: v22.1,62.87 22.61,63.37 23.85,63.37 24.28,62.94 25.53,62.94 27.26,61.21 v29.21,61.21
  Bottom 0.152: J8.4 10.5,65.13 11.5,64.13 11.5,62.38 12.41,61.47 14.86,61.47 16.26,62.87 v22.1,62.87 | B1.7 50.67,57.15 49.13,58.7 47.02,58.7 46.88,58.55 31.88,58.55 v29.21,61.21
VCC_1  (via drill 0.35)
  Top 0.152: U7.5 25.5,66.13 25.5,66.88 24.75,66.88 23.75,67.88 23.75,68.32 21.96,70.11 21.96,71.63 | 23,73.88 Q8.2 | 22.25,73.88 22.75,73.88 Q8.2 | J3.1 49.75,82.38 48,84.13 33,84.13 32,83.13 LED4.A 31.75,82.88 28.5,79.63 24.5,79.63 23.25,78.38 J12.2 19.19,82.17 6.35,82.17 5.08,80.9 J1.4 | R10.1 28.5,46.38 32,46.38 R14.1 32.25,46.38 36.5,46.38 37.5,47.38 Q2.E 38.99,46.23 v38.99,40.77 | R8.1 24.5,50.38 | R8.1 24.75,50.38 28.25,50.38 R4.2 28.5,50.13 28.5,46.63 R10.1 | 21,56.13 IC2.8 | J5.12 11.5,27.63 17.09,33.22 17.09,38.1 17.91,38.91 17.91,41.4 23.05,46.54 R6.1 24.5,46.63 24.71,46.42 R10.1 | 21.96,71.63 21.96,72.69 v21.25,73.41 | Q8.2 23.68,73.86 23.88,73.66 23.88,71.75 24,71.63 21.96,71.63 | IC2.8 21.21,57.79 20.62,58.38 9,58.38 6.5,55.88 2.54,55.88 B1.VIN | R8.1 23.43,50.48 23.05,50.86 23.05,52.45 22.86,52.64 v22.86,53.98 | v21.21,54.74 IC2.8 | v19.18,70.1 18.8,69.72 7.62,69.72 7.11,69.21 7.11,66.55 4.19,63.63 B1.5V@0 | B1.5V@2 B1.5V@1 46.86,11.56 v46.86,30.23
  Bottom 0.152: J12.2 23,78.13 23,77.63 21.25,75.88 v21.25,73.41 21.25,72.18 v19.18,70.1 | v21.21,54.74 21.21,54.48 21.46,54.48 21.97,53.98 v22.86,53.98 | B1.VIN 0.89,57.53 0.89,62.1 B1.5V@0 | v46.86,30.23 38.99,38.1 v38.99,40.77
VCC_2
  Top 0.152: R12.1 24.75,30.63 28.25,30.63 R11.1 28.5,30.38 29,29.88 33.75,29.88 Q5.2
  pour Bottom: 3.56,0.13 1.27,2.41 1.27,2.67 0,2.67 -0.13,2.79 -0.13,102.75 54.35,103.13 55.88,101.6 55.88,4.95 53.47,2.54 40.64,2.54 40.51,2.67 38.23,0.38 38.23,0 19.43,0
WAKE_LED
  Bottom 0.152: J10.1 20.75,23.13 23.01,25.39 23.01,26.03 23.37,26.39 24.01,26.39 33,35.38 33,36.63 42.22,45.85 B1.3
WAKE_SW  (via drill 0.35)
  Top 0.152: U7.3 25,67.63 25,68.07 25.38,68.46 v26.16,68.46 | v46.61,57.66 40.13,64.13 39.01,64.13 38.34,63.48 37.38,63.48 36.72,64.13 v31.24,64.13
  Bottom 0.152: J10.3 22.07,21.95 22.07,23.6 23.72,25.25 23.32,25.65 23.32,25.91 23.5,26.09 24.56,26.09 33.38,34.9 33.38,36.54 34.58,37.74 34.7,37.74 38.35,41.39 38.45,41.39 40.36,43.31 B1.2 51.94,44.58 51.94,46.23 51.84,46.33 51.16,47.02 50.19,47.02 50.16,46.99 50.04,46.99 46.61,50.42 v46.61,57.66 | v31.24,64.13 26.92,68.46 v26.16,68.46
WAKE_SW_BUF  (via drill 0.35)
  Top 0.152: U7.4 25.15,65.86 v25.15,64.39 | v25.15,62.23 25.4,61.98 25.4,60.2 25.4,59.94 JP3.1
  Bottom 0.152: v25.15,64.39 v25.15,62.23
XDIR  (via drill 0.35)
  Top 0.152: v29.97,68.88 29.75,68.88 25.56,73.06 25.56,74.77 23.9,76.43 12.22,76.43 11.43,77.21 11.43,78.87 J1.10
  Bottom 0.152: B1.9 49.98,63.3 49.98,63.58 44.47,69.09 30.48,69.09 30.27,68.88 v29.97,68.88
XSTEP  (via drill 0.35)
  Top 0.152: v46.61,63.63 46.61,63.66 40.89,69.38 33,69.38 33,76.66 32.51,77.15 19.75,77.15 18.03,78.87 13.97,78.87 J1.9
  Bottom 0.152: v46.61,63.63 50.16,60.07 B1.8
YDIR
  Bottom 0.152: B1.5 52.17,50.93 52.17,81.05 50.95,82.27 50.95,82.65 50.27,83.34 49.89,83.34 49.4,83.82 21.46,83.82 J1.11
YSTEP
  Bottom 0.152: B1.4 52.07,48.39 52.48,48.79 52.48,81.18 51.26,82.4 51.26,82.78 50.39,83.64 50.09,83.64 49.4,84.33 19.43,84.33 J1.12

### Text on the board
tValues: Valid combinations: | 168V / 3.3V Reg / 8MHz | 168 / 5V Reg / 16MHz | 168 / 5V Reg / 20MHz | Mark back accordingly | Arduino Pro Mini